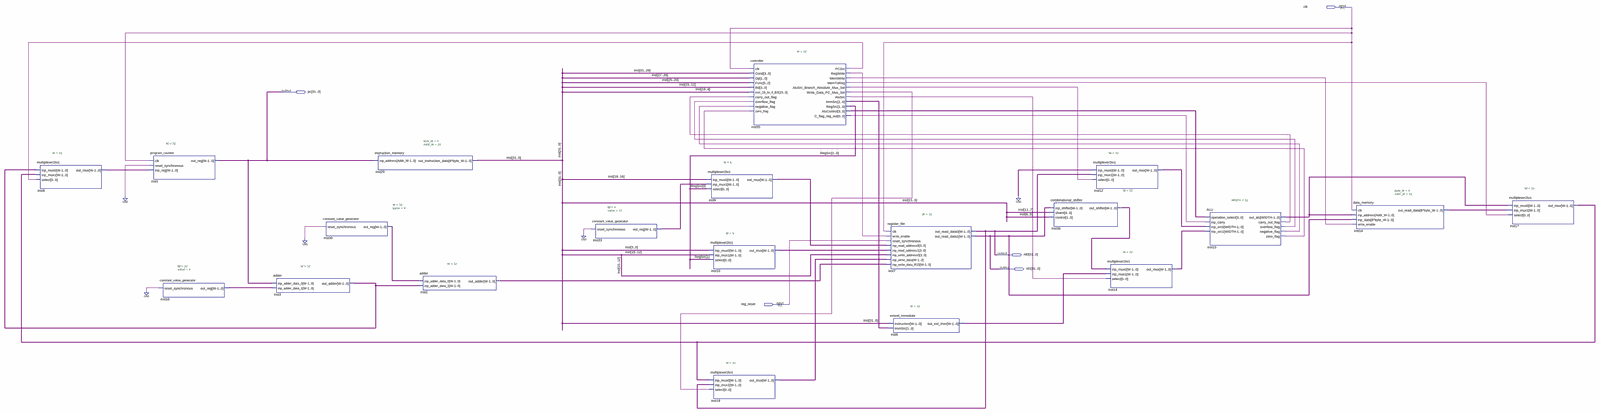
[diagram p0: schematic sheet, whole]
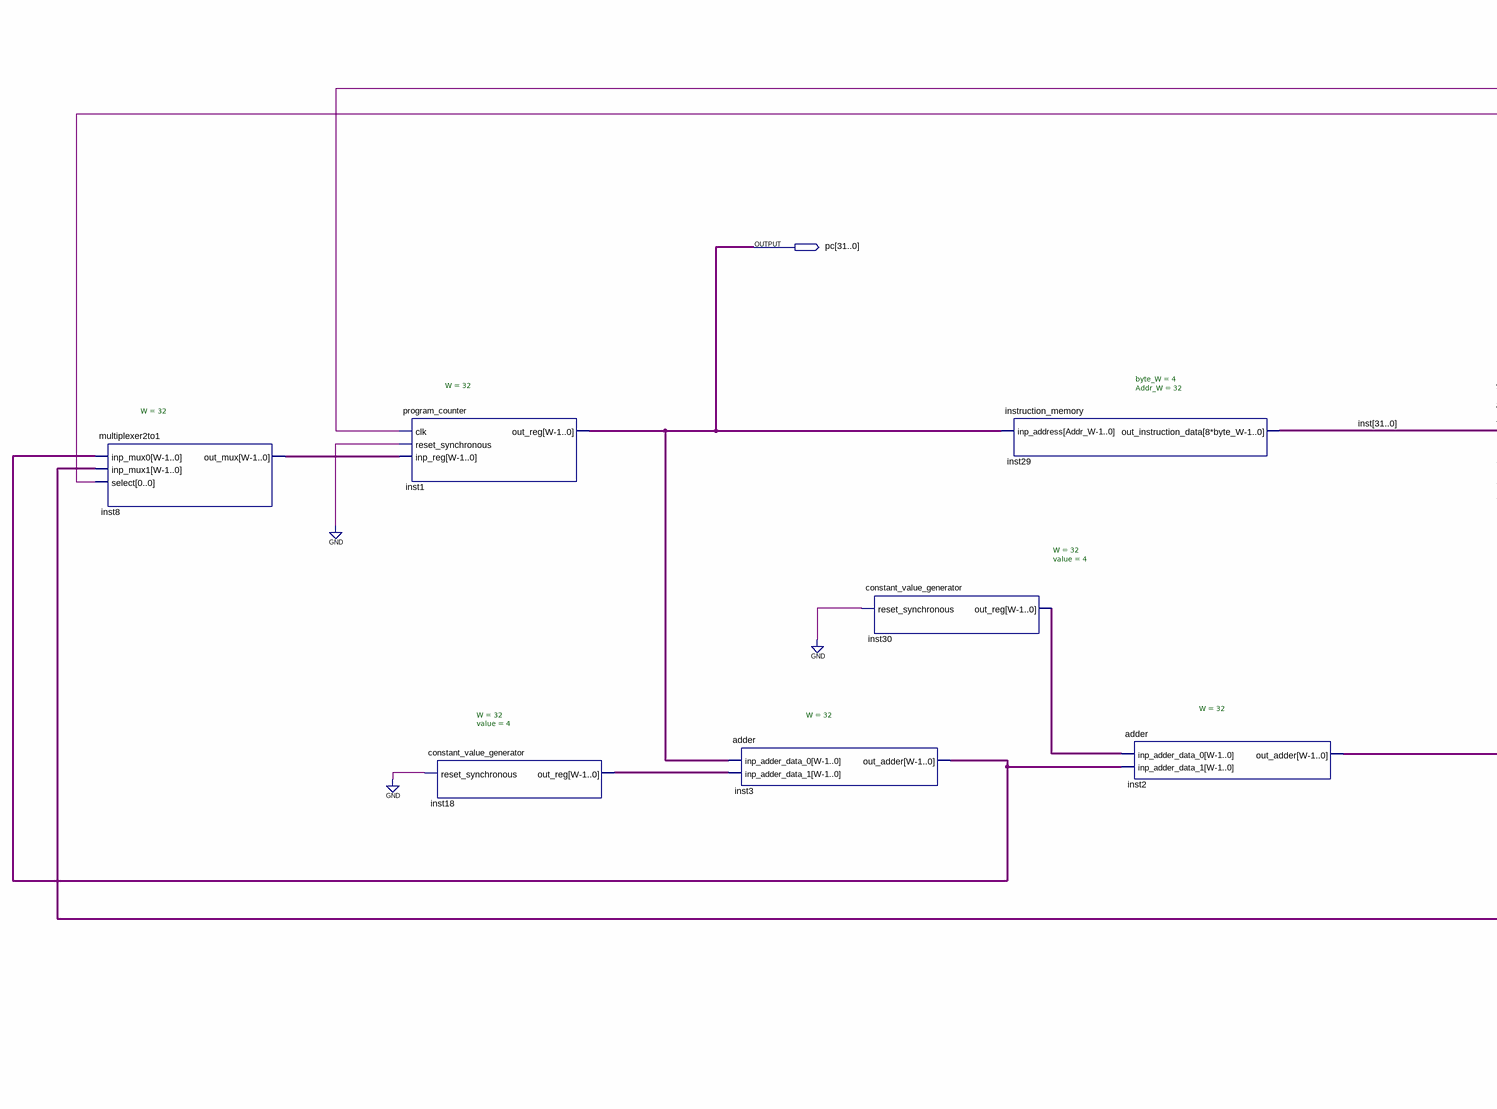
[diagram p1: schematic sheet, left part]
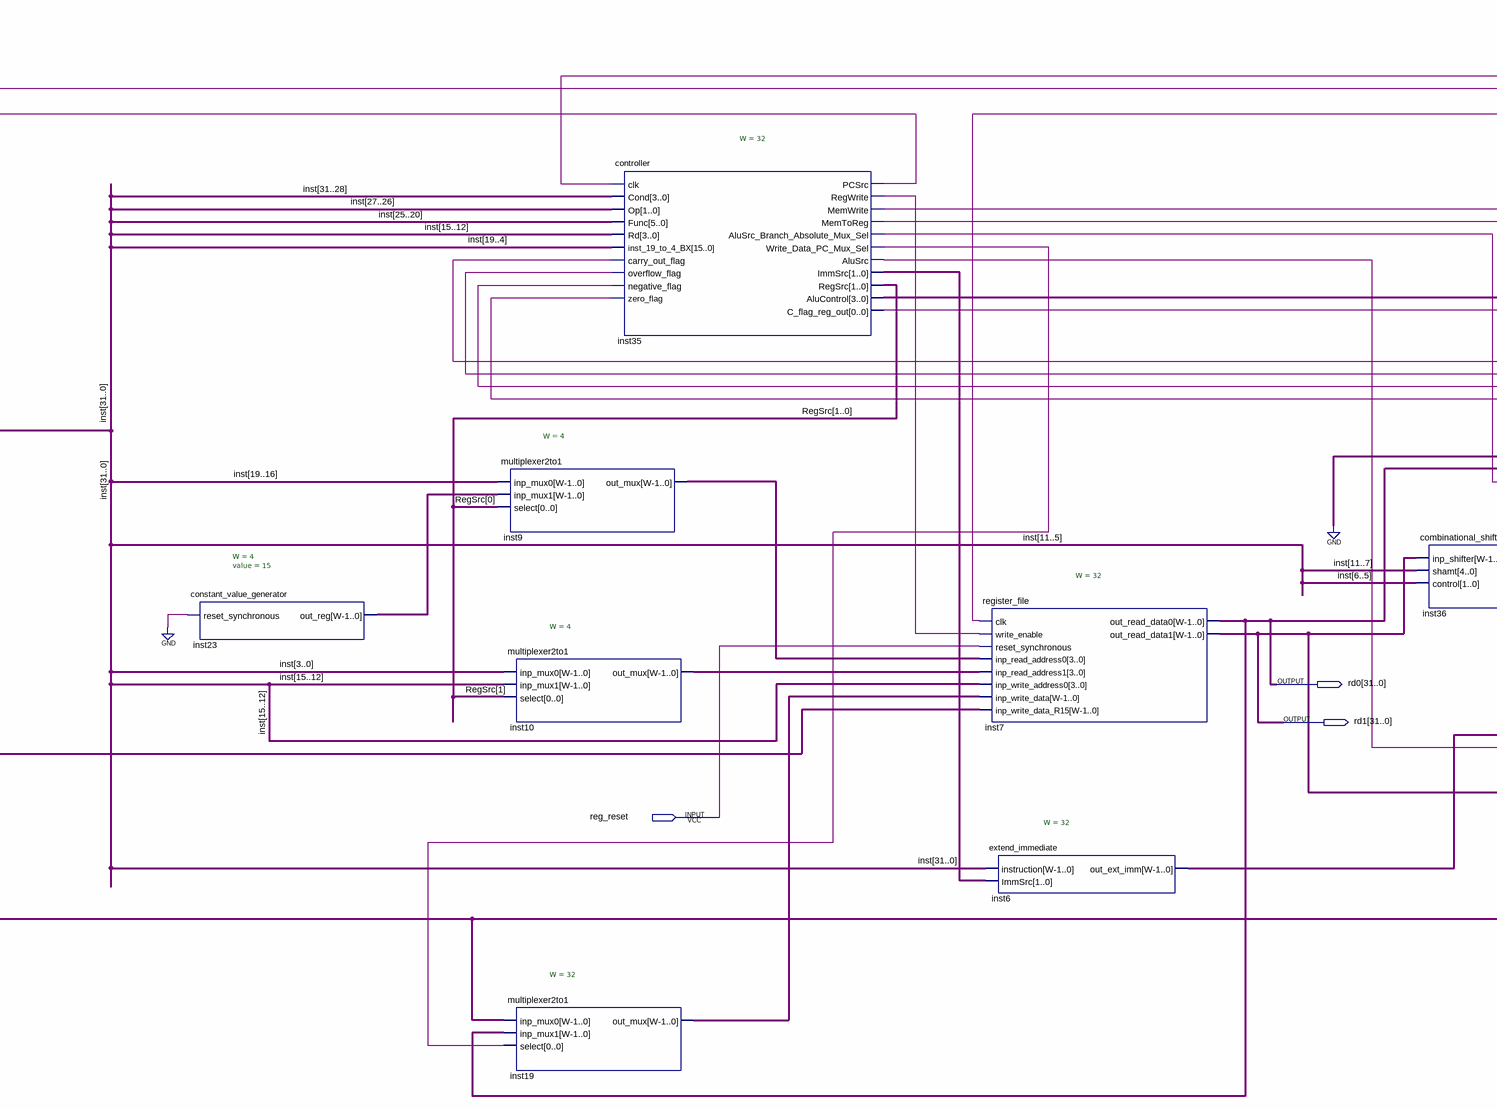
[diagram p2: schematic sheet, centre part]
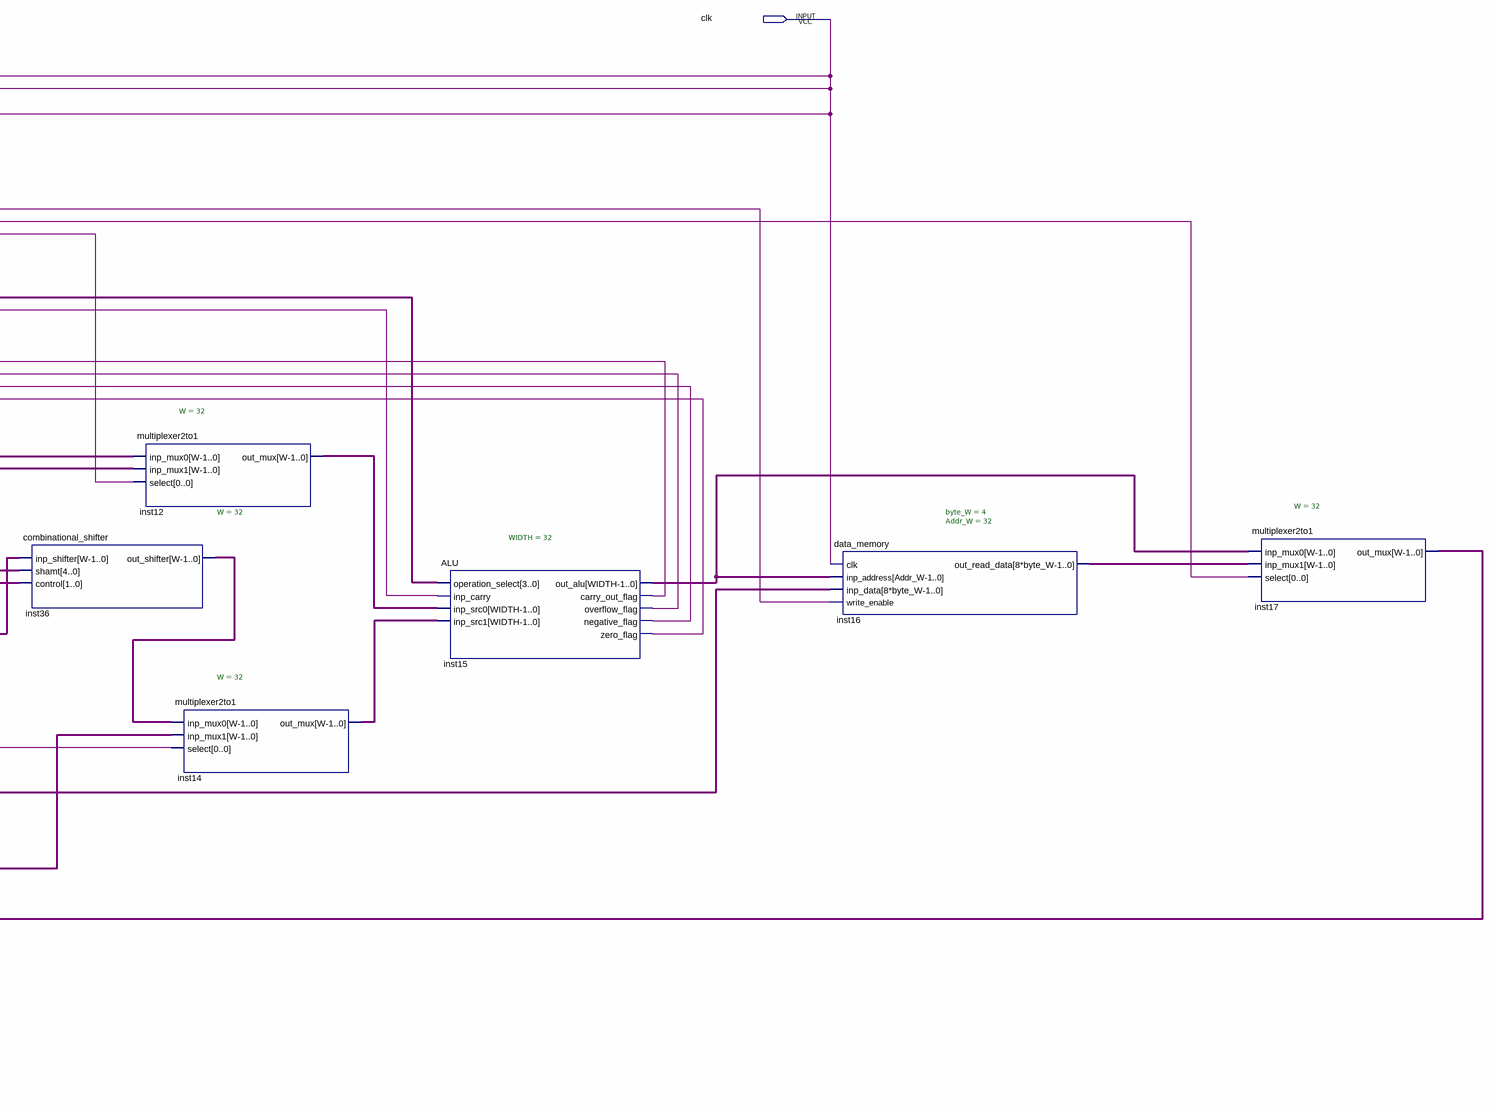
[diagram p3: schematic sheet, right part]
// Quartus schematic dp_lab2.bdf as structural Verilog: 20 symbols, 5 pins
module dp_lab2 (
  input  clk,
  input  reg_reset,
  output [31:0] pc,
  output [31:0] rd0,
  output [31:0] rd1
);

  wire inst15_carry_out_flag, inst15_negative_flag, inst15_overflow_flag, inst15_zero_flag, inst35_alusrc,
       inst35_alusrc_branch_absolute_mux_sel, inst35_c_flag_reg_out, inst35_memtoreg, inst35_memwrite,
       inst35_pcsrc, inst35_regwrite, inst35_write_data_pc_mux_sel;
  wire [1:0] inst35_immsrc, RegSrc;
  wire [3:0] inst9_out_mux, inst10_out_mux, inst23_out_reg, inst35_alucontrol;
  wire [31:0] inst, inst2_out_adder, inst3_out_adder, inst6_out_ext_imm, inst8_out_mux, inst12_out_mux,
       inst14_out_mux, inst15_out_alu, inst16_out_read_data, inst17_out_mux, inst18_out_reg, inst19_out_mux,
       inst30_out_reg, inst36_out_shifter;

  multiplexer2to1 #(.W(32)) inst8 (
    .inp_mux0(inst3_out_adder), .inp_mux1(inst17_out_mux), .select(inst35_pcsrc), .out_mux(inst8_out_mux));
  program_counter #(.W(32)) inst1 (.clk(clk), .reset_synchronous(1'b0), .inp_reg(inst8_out_mux), .out_reg(pc));
  constant_value_generator #(.W(32), .value(4)) inst18 (.reset_synchronous(1'b0), .out_reg(inst18_out_reg));
  adder #(.W(32)) inst3 (.inp_adder_data_0(pc), .inp_adder_data_1(inst18_out_reg), .out_adder(inst3_out_adder));
  constant_value_generator #(.W(32), .value(4)) inst30 (.reset_synchronous(1'b0), .out_reg(inst30_out_reg));
  instruction_memory #(.byte_W(4), .Addr_W(32)) inst29 (.inp_address(pc), .out_instruction_data(inst));
  adder #(.W(32)) inst2 (
    .inp_adder_data_0(inst30_out_reg), .inp_adder_data_1(inst3_out_adder), .out_adder(inst2_out_adder));
  constant_value_generator #(.W(4), .value(15)) inst23 (.reset_synchronous(1'b0), .out_reg(inst23_out_reg));
  multiplexer2to1 #(.W(4)) inst9 (
    .inp_mux0(inst[19:16]), .inp_mux1(inst23_out_reg), .select(RegSrc[0]), .out_mux(inst9_out_mux));
  multiplexer2to1 #(.W(4)) inst10 (
    .inp_mux0(inst[3:0]), .inp_mux1(inst[15:12]), .select(RegSrc[1]), .out_mux(inst10_out_mux));
  multiplexer2to1 #(.W(32)) inst19 (
    .inp_mux0(inst17_out_mux), .inp_mux1(rd0), .select(inst35_write_data_pc_mux_sel), .out_mux(inst19_out_mux));
  controller #(.W(32)) inst35 (
    .clk(clk), .Cond(inst[31:28]), .Op(inst[27:26]), .Func(inst[25:20]), .Rd(inst[15:12]),
    .inst_19_to_4_BX(inst[19:4]), .carry_out_flag(inst15_carry_out_flag),
    .overflow_flag(inst15_overflow_flag), .negative_flag(inst15_negative_flag), .zero_flag(inst15_zero_flag),
    .PCSrc(inst35_pcsrc), .RegWrite(inst35_regwrite), .MemWrite(inst35_memwrite), .MemToReg(inst35_memtoreg),
    .AluSrc_Branch_Absolute_Mux_Sel(inst35_alusrc_branch_absolute_mux_sel),
    .Write_Data_PC_Mux_Sel(inst35_write_data_pc_mux_sel), .AluSrc(inst35_alusrc), .ImmSrc(inst35_immsrc),
    .RegSrc(RegSrc), .AluControl(inst35_alucontrol), .C_flag_reg_out(inst35_c_flag_reg_out));
  register_file #(.W(32)) inst7 (
    .clk(clk), .write_enable(inst35_regwrite), .reset_synchronous(reg_reset),
    .inp_read_address0(inst9_out_mux), .inp_read_address1(inst10_out_mux), .inp_write_address0(inst[15:12]),
    .inp_write_data(inst19_out_mux), .inp_write_data_R15(inst2_out_adder), .out_read_data0(rd0),
    .out_read_data1(rd1));
  extend_immediate #(.W(32)) inst6 (.instruction(inst), .ImmSrc(inst35_immsrc), .out_ext_imm(inst6_out_ext_imm));
  combinational_shifter #(.W(32)) inst36 (
    .inp_shifter(rd1), .shamt(inst[11:7]), .control(inst[6:5]), .out_shifter(inst36_out_shifter));
  multiplexer2to1 #(.W(32)) inst12 (
    .inp_mux0({32{1'b0}}), .inp_mux1(rd0), .select(inst35_alusrc_branch_absolute_mux_sel),
    .out_mux(inst12_out_mux));
  multiplexer2to1 #(.W(32)) inst14 (
    .inp_mux0(inst36_out_shifter), .inp_mux1(inst6_out_ext_imm), .select(inst35_alusrc),
    .out_mux(inst14_out_mux));
  ALU #(.WIDTH(32)) inst15 (
    .operation_select(inst35_alucontrol), .inp_carry(inst35_c_flag_reg_out), .inp_src0(inst12_out_mux),
    .inp_src1(inst14_out_mux), .out_alu(inst15_out_alu), .carry_out_flag(inst15_carry_out_flag),
    .overflow_flag(inst15_overflow_flag), .negative_flag(inst15_negative_flag), .zero_flag(inst15_zero_flag));
  data_memory #(.byte_W(4), .Addr_W(32)) inst16 (
    .clk(clk), .inp_address(inst15_out_alu), .inp_data(rd1), .write_enable(inst35_memwrite),
    .out_read_data(inst16_out_read_data));
  multiplexer2to1 #(.W(32)) inst17 (
    .inp_mux0(inst15_out_alu), .inp_mux1(inst16_out_read_data), .select(inst35_memtoreg),
    .out_mux(inst17_out_mux));
endmodule
